# Altium schematic sheet top.SchDoc
size A
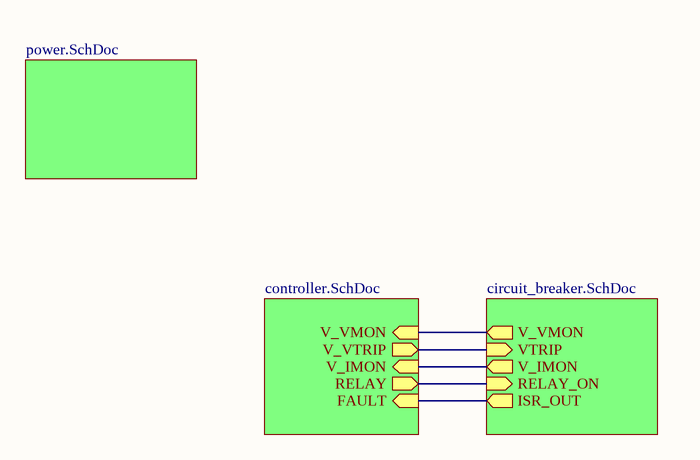
[diagram p0: top.SchDoc]

## Sub-sheets
? = controller.SchDoc: V_VTRIP (out), V_IMON (in), V_VMON (in), FAULT (in), RELAY (out)
? = circuit_breaker.SchDoc: RELAY_ON (in), V_VMON (out), V_IMON (out), ISR_OUT (out), VTRIP (in)
? = power.SchDoc: no entries

## Nets
(unnamed): sheet /V_VTRIP, sheet /VTRIP
(unnamed): sheet /V_IMON, sheet /V_IMON
(unnamed): sheet /V_VMON, sheet /V_VMON
(unnamed): sheet /FAULT, sheet /ISR_OUT
(unnamed): sheet /RELAY, sheet /RELAY_ON